# Altium schematic sheet Power.SchDoc: Power Schematic
size A4; DrawnBy: Ian Glass; Revision: 1; SheetNumber: 3; SheetTotal: 3
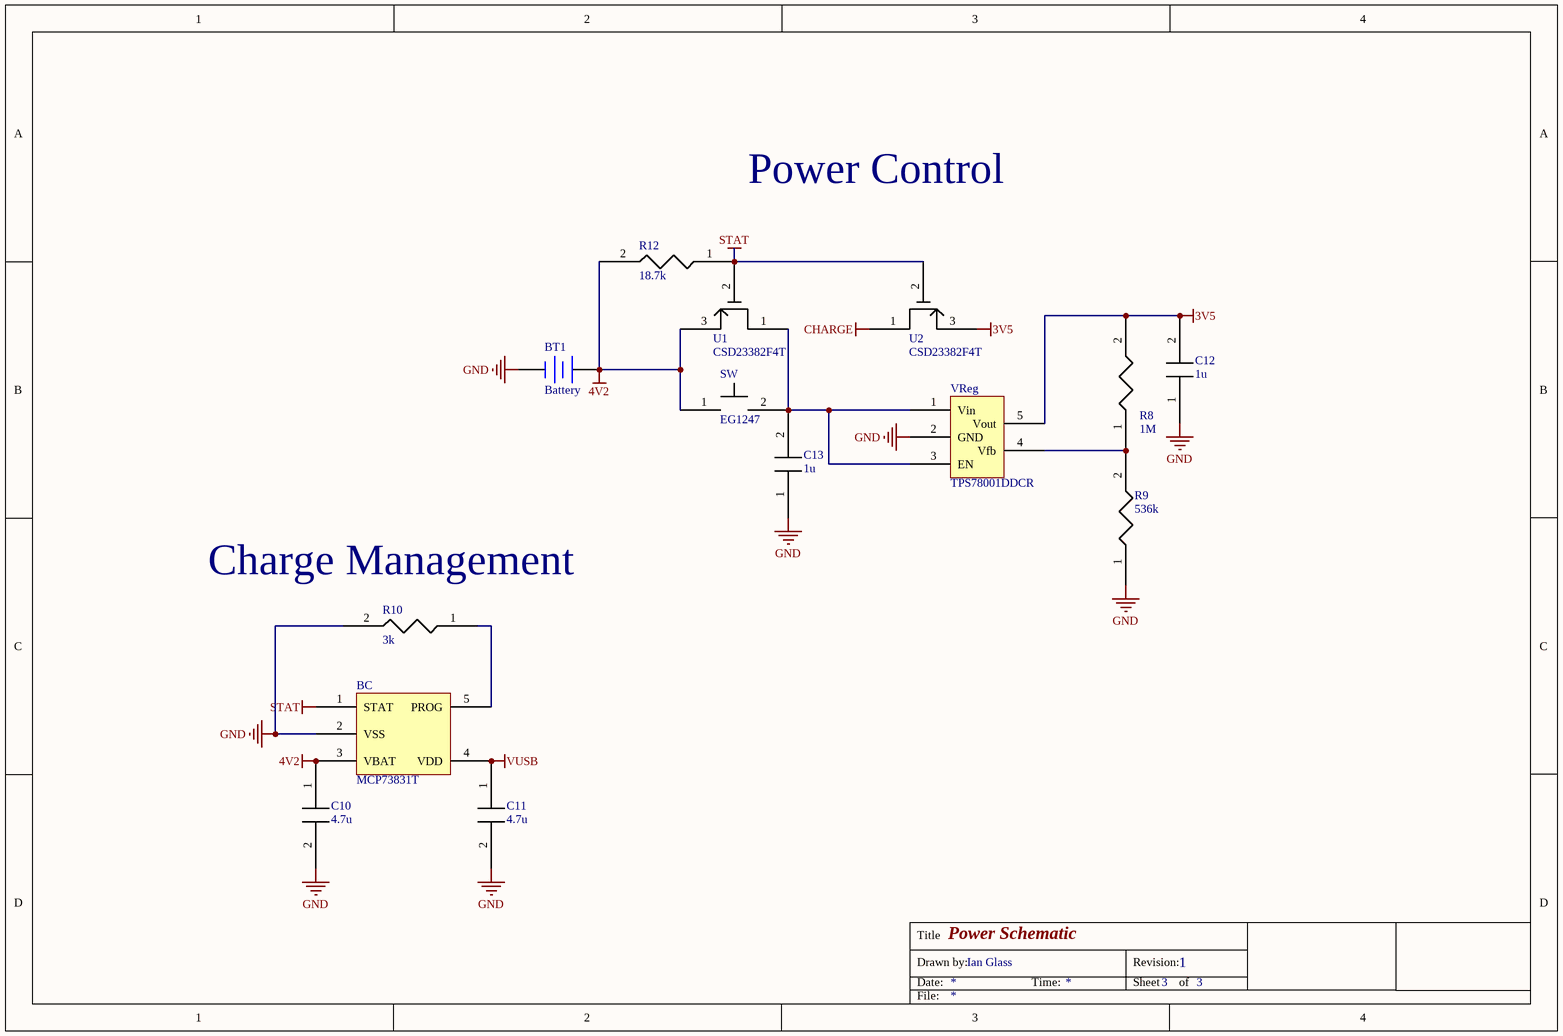
[diagram p0: Power.SchDoc]

## Parts
BC  MCP73831T  [MCP73831T]
BT1  Battery  [BAT-2]
C10  4.7u  [Capacitor 0805]
C11  4.7u  [Capacitor 0805]
C12  1u  [Capacitor 0402]
C13  1u  [Capacitor 0402]
R8  1M  [Resistor 0403]
R9  536k  [Resistor 0603]
R10  3k  [Resistor 0603]
R12  18.7k  [Resistor 0403]
SW  EG1247  [EG1247]
U1  CSD23382F4T  [CSD23382F4T]
U2  CSD23382F4T  [CSD23382F4T]
VReg  TPS78001DDCR  [TPS78001DDCR]

## Nets
3V5: C12.2 R8.2 U2.3 VReg.5(Vout)
4V2: BC.3(VBAT) BT1.1(+) C10.1 R12.2 SW.1 U1.3
CHARGE: U2.1
GND: BC.2(VSS) BT1.2(-) C10.2 C11.2 C12.1 C13.1 R9.1 R10.2 VReg.2(GND)
STAT: BC.1(STAT) R12.1 U1.2 U2.2
VUSB: BC.4(VDD) C11.1
NetBC_5: BC.5(PROG) R10.1
NetC13_2: C13.2 SW.2 U1.1 VReg.1(Vin) VReg.3(EN)
NetR8_1: R8.1 R9.2 VReg.4(Vfb)

## Notes on the sheet
- Power Control
- (near R10) Charge Management
- Title
- Drawn by:
- Date:
- Time:
- Revision:
- Sheet
- of
- File:

## Library data of the parts
BT1 = Battery: Multicell Battery; Published: 24-Mar-1999; LatestRevisionDate: 17-Jul-2002; LatestRevisionNote: Re-released for DXP Platform.; PackageReference: BAT-2; Publisher: Altium Limited; PackageDescription: Battery; 2 Leads
C10 C11 = Capacitor 0805
C12 C13 = Capacitor 0402
R8 R12 = Resistor 0403
R9 R10 = Resistor 0603